# Altium project AC_PhaseSelector.PrjPcb
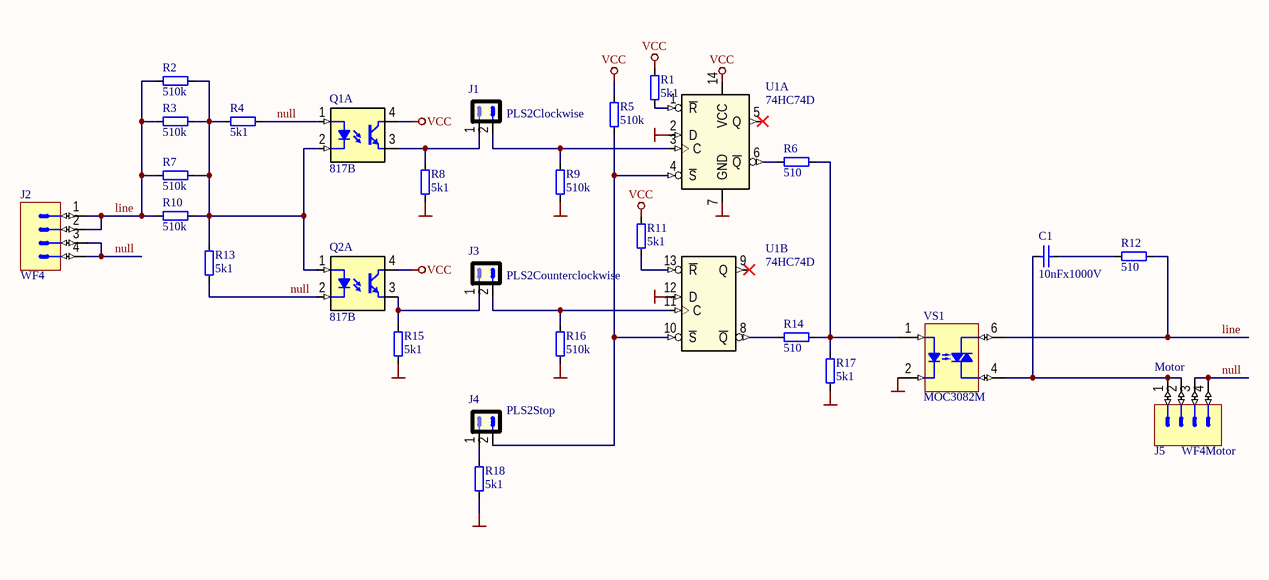
[diagram p0: AC_PhSel.SchDoc]
1 sheet, 28 parts. Net scope: global (net labels, ports and power ports of the same name join across sheets).

## Sheet AC_PhSel.SchDoc
size 594 x 420 mm; Address1: Address1; Address2: Address2; Address3: Address3; Address4: Address4; SheetNumber: 1; Scale: 1:1; Обозначение документа: АБВГ.123456.001 Э3

### Parts
C1  10nFx1000V  [CAPC1206]
J1  PLS2Сlockwise  [PLS2]
J2  WF4  [WF4_2_54]
J3  PLS2Counterclockwise  [PLS2]
J4  PLS2Stop  [PLS2]
J5  WF4Motor  value Motor  [WF4_2_54]
Q1  817B  (parts A,B of 2)
Q2  817B  (part A of 2)
R1  5k1  [RESC3016X65N]
R2  510k  [RESC3016X65N]
R3  510k  [RESC3016X65N]
R4  5k1  [RESC3016X65N]
R5  510k  [RESC3016X65N]
R6  510  [RESC3016X65N]
R7  510k  [RESC3016X65N]
R8  5k1  [RESC3016X65N]
R9  510k  [RESC3016X65N]
R10  510k  [RESC3016X65N]
R11  5k1  [RESC3016X65N]
R12  510  [RESC3016X65N]
R13  5k1  [RESC3016X65N]
R14  510  [RESC3016X65N]
R15  5k1  [RESC3016X65N]
R16  510k  [RESC3016X65N]
R17  5k1  [RESC3016X65N]
R18  5k1  [RESC3016X65N]
U1  74HC74D  [SOIC127P600X175-14N]  (parts A,B of 2)
VS1  MOC3082M  [DIP6-300]

### Nets
GND: R8.1 R9.1 R15.1 R16.1 R17.1 R18.1 U1.2(D) U1.7(GND) U1.12(D) VS1.2(C)
VCC: Q1.4(C) Q2.4(C) R1.2 R5.2 R11.2 U1.14(VCC)
line: J2.1 J2.2 R2.1 R3.1 R7.1 R10.1 R12.1 VS1.6
null: J2.3 J2.4 J5.3 J5.4 Q1.1(A) Q2.2(C) R4.1 R13.1
NetC1_1: C1.1 J5.1 J5.2 VS1.4
NetC1_2: C1.2 R12.2
NetJ1_1: J1.1 Q1.3(E) R8.2
NetJ1_2: J1.2 R9.2 U1.3(C)
NetJ3_1: J3.1 Q2.3(E) R15.2
NetJ3_2: J3.2 R16.2 U1.11(C)
NetJ4_1: J4.1 R18.2
NetJ4_2: J4.2 R5.1 U1.4(~{S}) U1.10(~{S})
NetQ1_2: Q1.2(C) Q2.1(A) R2.2 R3.2 R4.2 R7.2 R10.2 R13.2
NetR1_1: R1.1 U1.1(~{R})
NetR6_1: R6.1 R14.1 R17.2 VS1.1(A)
NetR6_2: R6.2 U1.6(~{Q})
NetR11_1: R11.1 U1.13(~{R})
NetR14_2: R14.2 U1.8(~{Q})

Not connected (* = marked no-connect by the designer): U1 5(Q)* 9(Q)*

### Notes on the sheet
- Перв. примен.
- Справ. №
- Подп. и дата
- Инв. № дубл.
- Взам. инв. №
- Разраб.
- Изм.
- Лист
- № докум.
- Подп.
- Дата
- Лит.
- Масса
- Масштаб
- Пров.
- Т.контр.
- Листов
- Инв. № подл.
- Утв.
- Н.контр.
- Копировал
- Формат А2

### Library data of the parts
C1 = C1206: Чип конденсатор 0805; Voltage: 16V; Vendor: Vishay; DielectricType: X5R; SMD Solders: 2; Solder Option: RM; Tolerance: 1%; Pkg: SMD1206; Device: Cap1206; Value: 10nFx1000V; Price: 2
J1 J3 = PLS2: Vendor: Confly; SMD Solders: 0; Solder Option: RM; THD Solders: 2; Price: 1; Device: PLS2
  J1: Value: Сlockwise
  J3: Value: Counterclockwise
J2 J5 = WF4: Вилка  WF4; Vendor: Confly; SMD Solders: 0; Solder Option: RM; THD Solders: 4; Price: 20; Device: WF4
J4 = PLS2: Vendor: Confly; Value: Stop; SMD Solders: 0; Solder Option: RM; THD Solders: 2; Price: 1; Device: PLS2
Q1 Q2 = 817B: Optotransistor; Pkg: DIP4; SMD Solders: 0; Solder Option: RM; THD Solders: 4; Vendor: UMW; Voltage: 35V; Device: 817B; Price: 10; Name to order: 817B; Current: 0
R1-R18 = R1206: Чип резистор 1206; Vendor: Vishay; SMD Solders: 2; Solder Option: RM; TC: 100ppm/C; Tolerance: 1%; Pkg: SMD1206; Pwr: 250mW; Device: Res1206; Price: 2
  R1 R4 R8 R11 R13 R15 R17 R18: Value: 5k1
  R2 R3 R5 R7 R9 R10 R16: Value: 510k
  R6 R12 R14: Value: 510
U1 = 74HC74D: Positive LDO Linear stabilizer; Vendor: NXP; Pkg: SOIC14; SMD Solders: 14; Solder Option: RM; Voltage: 2.. 6V; Price: 50; Device: 74HC74D; Name to order: 74HC74D
VS1 = MOC3082: Bufer CMOS in to 2xLVDS out; Vendor: Faichild; Pkg: DFN045-13; SMD Solders: 0; Solder Option: outSrc; THD Solders: 6; Current: 100; Voltage: 600B; Price: 200; Device: MOC3082M; Name to order: MOC3082M